# EAGLE design BayThreat (EAGLE 5.11)

## Sheet 1 of 3
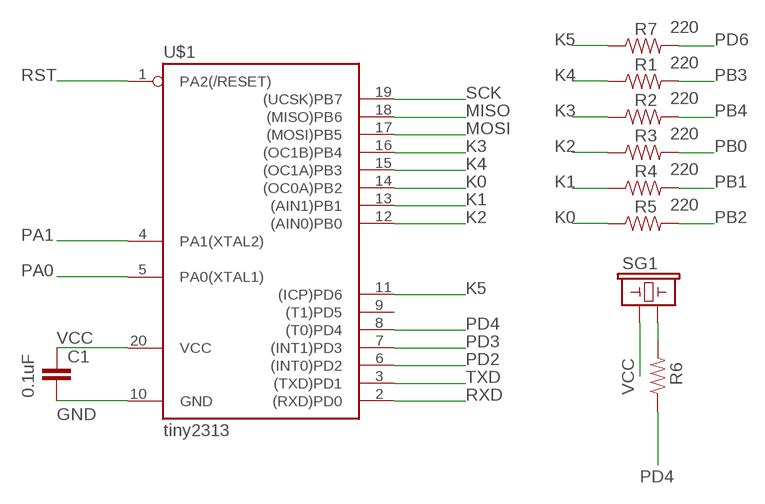
[diagram p0: schematic, sheet 1]

### Parts
C1  0.1uF  CAP_  [AXIAL-5MM]
R1  220  RESISTORPTH1  [AXIAL-0.3]
R2  220  RESISTORPTH1  [AXIAL-0.3]
R3  220  RESISTORPTH1  [AXIAL-0.3]
R4  220  RESISTORPTH1  [AXIAL-0.3]
R5  220  RESISTORPTH1  [AXIAL-0.3]
R6  RESISTORPTH1  [AXIAL-0.3]
R7  220  RESISTORPTH1  [AXIAL-0.3]
SG1  BUZZERPTH  [BUZZER-12MM]
U$1  tiny2313  TINY2313-*P*  [DIL20]

### Nets
GND: C1.P$2 U$1.10(GND) ; also sheet 3
K0 [LED]: R5.P$1 U$1.14((OC0A)PB2)
K1 [LED]: R4.P$1 U$1.13((AIN1)PB1)
K2 [LED]: R3.P$1 U$1.12((AIN0)PB0)
K3 [LED]: R2.P$1 U$1.16((OC1B)PB4)
K4 [LED]: R1.P$1 U$1.15((OC1A)PB3)
K5: R7.P$1 U$1.11((ICP)PD6)
MISO: U$1.18((MISO)PB6) ; also sheet 3
MOSI: U$1.17((MOSI)PB5) ; also sheet 3
N$4: R6.P$2 SG1.-
PA0: U$1.5(PA0(XTAL1))
PA1: U$1.4(PA1(XTAL2))
PB0: R3.P$2 ; also sheet 2
PB1: R4.P$2 ; also sheet 2
PB2 [LED]: R5.P$2 ; also sheet 2
PB3: R1.P$2 ; also sheet 2
PB4: R2.P$2 ; also sheet 2
PD2: U$1.6((INT0)PD2) ; also sheet 3
PD3: U$1.7((INT1)PD3)
PD4: R6.P$1 U$1.8((T0)PD4)
PD6: R7.P$2 ; also sheet 2
RST: U$1.1(PA2(/RESET)) ; also sheet 3
RXD: U$1.2((RXD)PD0)
SCK: U$1.19((UCSK)PB7) ; also sheet 3
TXD: U$1.3((TXD)PD1)
VCC: C1.P$1 SG1.+ U$1.20(VCC) ; also sheet 3
Unconnected: U$1.9((T1)PD5)

## Sheet 2 of 3
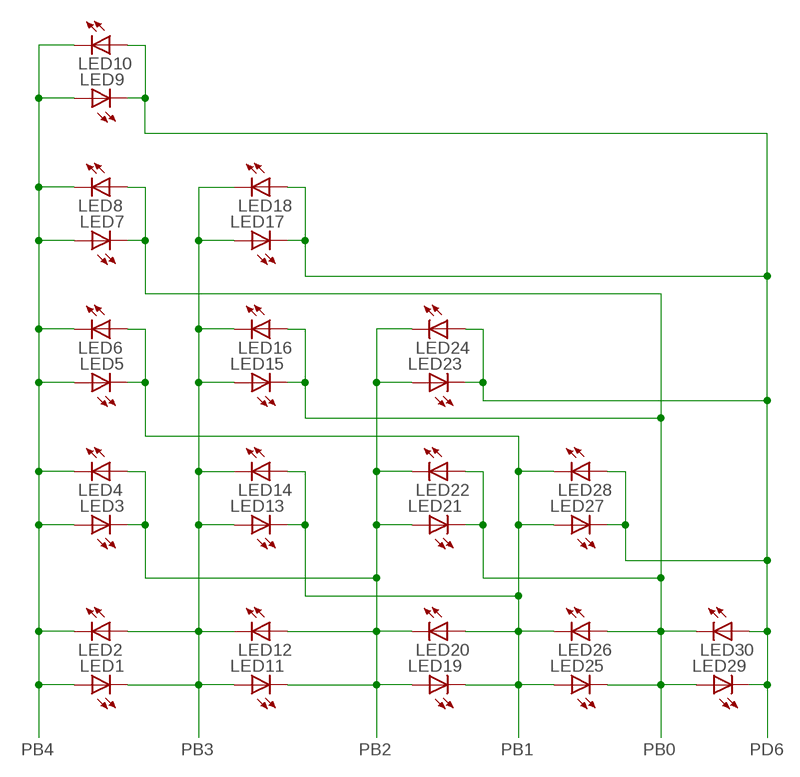
[diagram p1: schematic, sheet 2]

### Parts
LED1  LED3MM  [LED3MM]
LED2  LED3MM  [LED3MM]
LED3  LED3MM  [LED3MM]
LED4  LED3MM  [LED3MM]
LED5  LED3MM  [LED3MM]
LED6  LED3MM  [LED3MM]
LED7  LED3MM  [LED3MM]
LED8  LED3MM  [LED3MM]
LED9  LED3MM  [LED3MM]
LED10  LED3MM  [LED3MM]
LED11  LED3MM  [LED3MM]
LED12  LED3MM  [LED3MM]
LED13  LED3MM  [LED3MM]
LED14  LED3MM  [LED3MM]
LED15  LED3MM  [LED3MM]
LED16  LED3MM  [LED3MM]
LED17  LED3MM  [LED3MM]
LED18  LED3MM  [LED3MM]
LED19  LED3MM  [LED3MM]
LED20  LED3MM  [LED3MM]
LED21  LED3MM  [LED3MM]
LED22  LED3MM  [LED3MM]
LED23  LED3MM  [LED3MM]
LED24  LED3MM  [LED3MM]
LED25  LED3MM  [LED3MM]
LED26  LED3MM  [LED3MM]
LED27  LED3MM  [LED3MM]
LED28  LED3MM  [LED3MM]
LED29  LED3MM  [LED3MM]
LED30  LED3MM  [LED3MM]

### Nets
PB0: LED7.K(C) LED8.A LED15.K(C) LED16.A LED21.K(C) LED22.A LED25.K(C) LED26.A LED29.A LED30.K(C) ; also sheet 1
PB1: LED5.K(C) LED6.A LED13.K(C) LED14.A LED19.K(C) LED20.A LED25.A LED26.K(C) LED27.A LED28.K(C) ; also sheet 1
PB2 [LED]: LED3.K(C) LED4.A LED11.K(C) LED12.A LED19.A LED20.K(C) LED21.A LED22.K(C) LED23.A LED24.K(C) ; also sheet 1
PB3: LED1.K(C) LED2.A LED11.A LED12.K(C) LED13.A LED14.K(C) LED15.A LED16.K(C) LED17.A LED18.K(C) ; also sheet 1
PB4: LED1.A LED2.K(C) LED3.A LED4.K(C) LED5.A LED6.K(C) LED7.A LED8.K(C) LED9.A LED10.K(C) ; also sheet 1
PD6: LED9.K(C) LED10.A LED17.K(C) LED18.A LED23.K(C) LED24.A LED27.K(C) LED28.A LED29.K(C) LED30.A ; also sheet 1

## Sheet 3 of 3
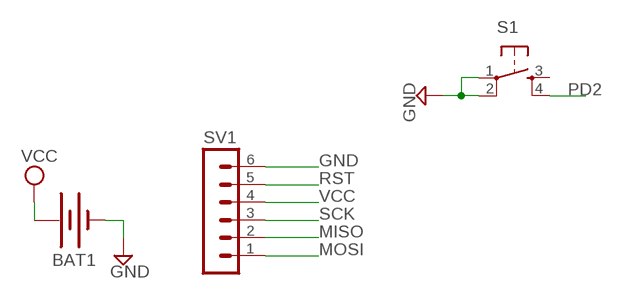
[diagram p2: schematic, sheet 3]

### Parts
BAT1  SPARKFUN_BATTERY245PTH  [SPARKFUN_BATTCON_245MM_PTH]
S1  TAC_SWITCHPTH  [TACTILE-PTH]
SV1  MA06-1  [MA06-1]

### Nets
GND: BAT1.2(-) S1.1 S1.2 SV1.6 ; also sheet 1
MISO: SV1.2 ; also sheet 1
MOSI: SV1.1 ; also sheet 1
PD2: S1.4 ; also sheet 1
RST: SV1.5 ; also sheet 1
SCK: SV1.3 ; also sheet 1
VCC: BAT1.3(+) SV1.4 ; also sheet 1
Unconnected: S1.3

## Library data of the parts
BAT1 = NSL:SPARKFUN_BATTERY: Battery Holders Various common sizes : AA, AAA, 20mm coin cell and 12mm coin cell.
C1 = SparkFun:CAP: Capacitor Standard 0603 ceramic capacitor, and 0.1" leaded capacitor.
LED1-LED30 = led:LED: LED OSRAM: - CHIPLED LG R971, LG N971, LY N971, LG Q971, LY Q971, LO R971, LY R971 LH N974, LH R974 LS Q976, LO Q976, LY Q976 LO Q996 - Hyper CHIPLED LW Q18S LB Q993, LB Q99A, LB R99A - SideLED LS A670, LO A670, LY A670, LG A670, LP A670 LB A673, LV A673, LT A673, LW A673 LH A674 LY A675 LS A676, LA A676, LO A676, LY A676, LW A676 LS A679, LY A679, LG A679 - Hyper Micro SIDELED® LS Y876, LA Y876, LO Y876, LY Y876 LT Y87S - SmartLED LW L88C, LW L88S LB L89C, LB L89S, LG L890 LS L89K, LO L89K, LY L89K LS L896, LA L896, LO L896, LY L896 - TOPLED LS T670, LO T670, LY T670, LG T670, LP T670 LSG T670, LSP T670, LSY T670, LOP T670, LYG T670 LG T671, LOG T671, LSG T671 LB T673, LV T673, LT T673, LW T673 LH T674 LS T676, LA T676, LO T676, LY T676, LB T676, LH T676, LSB T676, LW T676 LB T67C, LV T67C, LT T67C, LS T67K, LO T67K, LY T67K, LW E67C LS E67B, LA E67B, LO E67B, LY E67B, LB E67C, LV E67C, LT E67C LW T67C LS T679, LY T679, LG T679 LS T770, LO T770, LY T770, LG T770, LP T770 LB T773, LV T773, LT T773, LW T773 LH T774 LS E675, LA E675, LY E675, LS T675 LS T776, LA T776, LO T776, LY T776, LB T776 LHGB T686 LT T68C, LB T68C - Hyper Mini TOPLED® LB M676 - Mini TOPLED Santana® LG M470 LS M47K, LO M47K, LY M47K Source: http://www.osram.convergy.de LUXEON: - LUMILED® LXK2-PW12-R00, LXK2-PW12-S00, LXK2-PW14-U00, LXK2-PW14-V00 LXK2-PM12-R00, LXK2-PM12-S00, LXK2-PM14-U00 LXK2-PE12-Q00, LXK2-PE12-R00, LXK2-PE12-S00, LXK2-PE14-T00, LXK2-PE14-U00 LXK2-PB12-K00, LXK2-PB12-L00, LXK2-PB12-M00, LXK2-PB14-N00, LXK2-PB14-P00, LXK2-PB14-Q00 LXK2-PR12-L00, LXK2-PR12-M00, LXK2-PR14-Q00, LXK2-PR14-R00 LXK2-PD12-Q00, LXK2-PD12-R00, LXK2-PD12-S00 LXK2-PH12-R00, LXK2-PH12-S00 LXK2-PL12-P00, LXK2-PL12-Q00, LXK2-PL12-R00 Source: www.luxeon.com KINGBRIGHT: KA-3528ASYC Source: www.kingbright.com
R1-R5 R7 = NSL:RESISTOR: Resistor Basic schematic elements and footprints for 0603, 1206, and PTH 1/10th watt (small) resistors.
R6 = SparkFun:RESISTOR: Resistor Basic schematic elements and footprints for 0603, 1206, and PTH 1/10th watt (small) resistors.
S1 = SparkFun:TAC_SWITCH: Momentary Switch Button commonly used for reset or general input. Spark Fun Electronics SKU : COM-00097
SG1 = SparkFun:BUZZER: Buzzer 12mm Spark Fun Electronics SKU : Comp-Buzzer
SV1 = NSL:MA06-1: PIN HEADER
U$1 = NSL_Cylon:TINY2313*: Atmel Tiny2313 2K Flash, 128 bytes EEPROM, 128 bytes RAM

## Net classes
0 default: width 0.254 mm
1 LED: width 0.203 mm

## Board
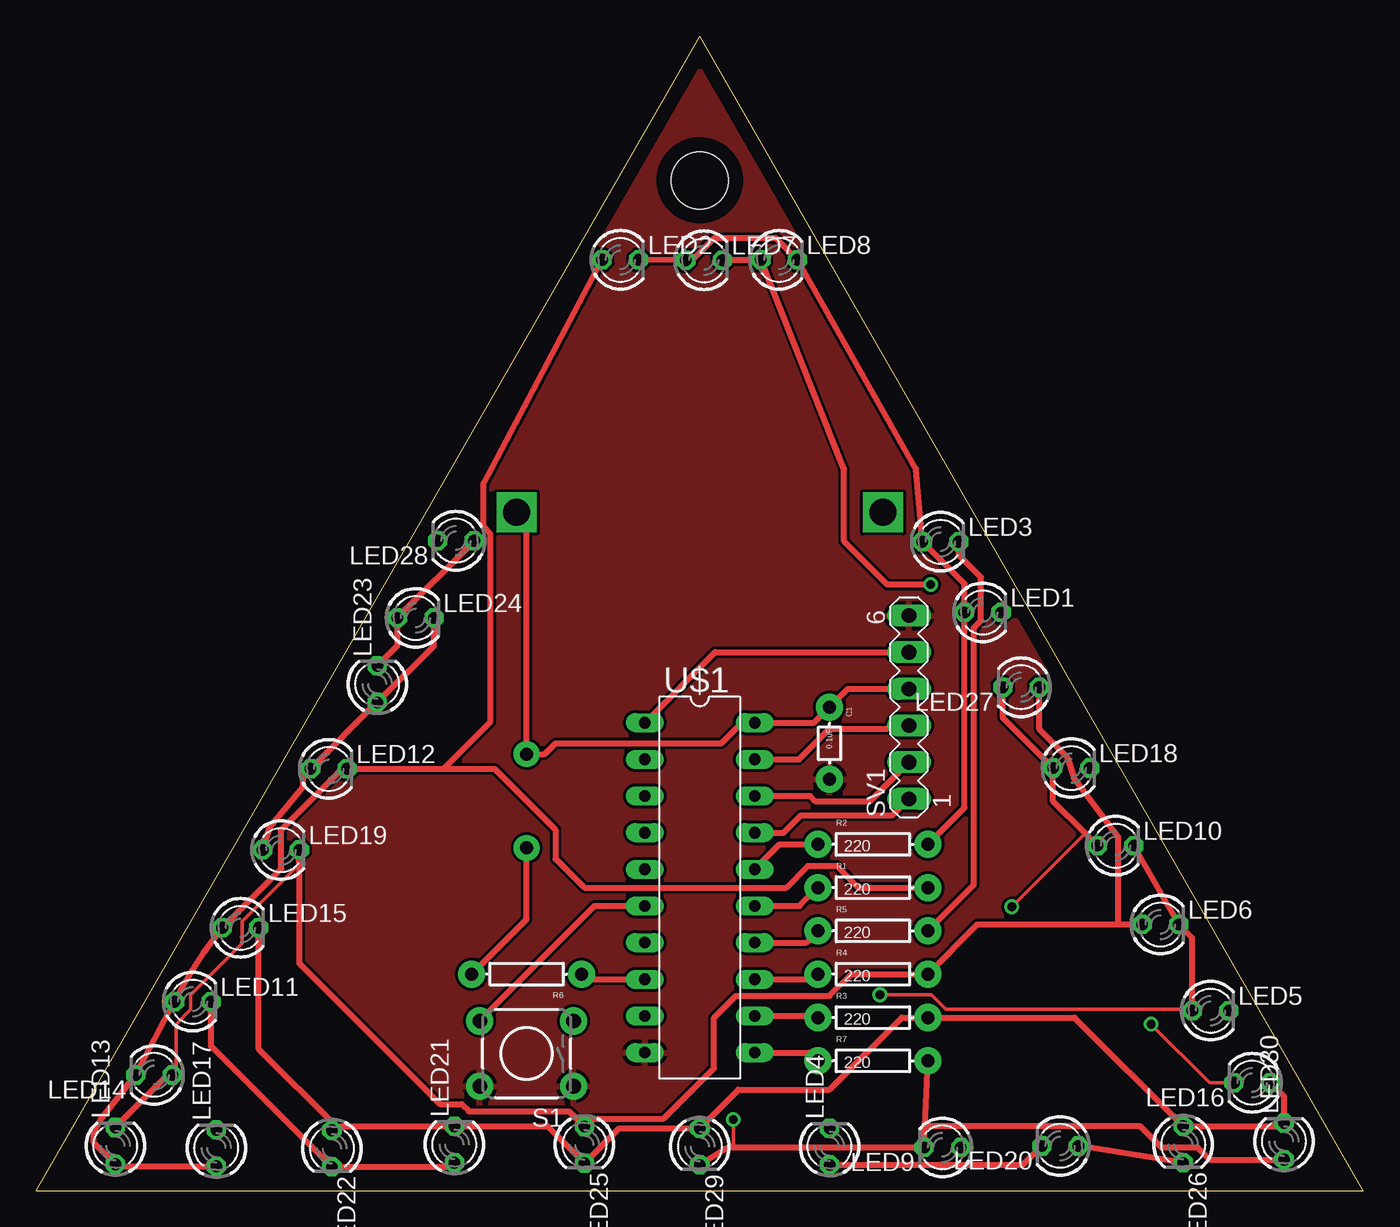
[diagram p3: board, top side]
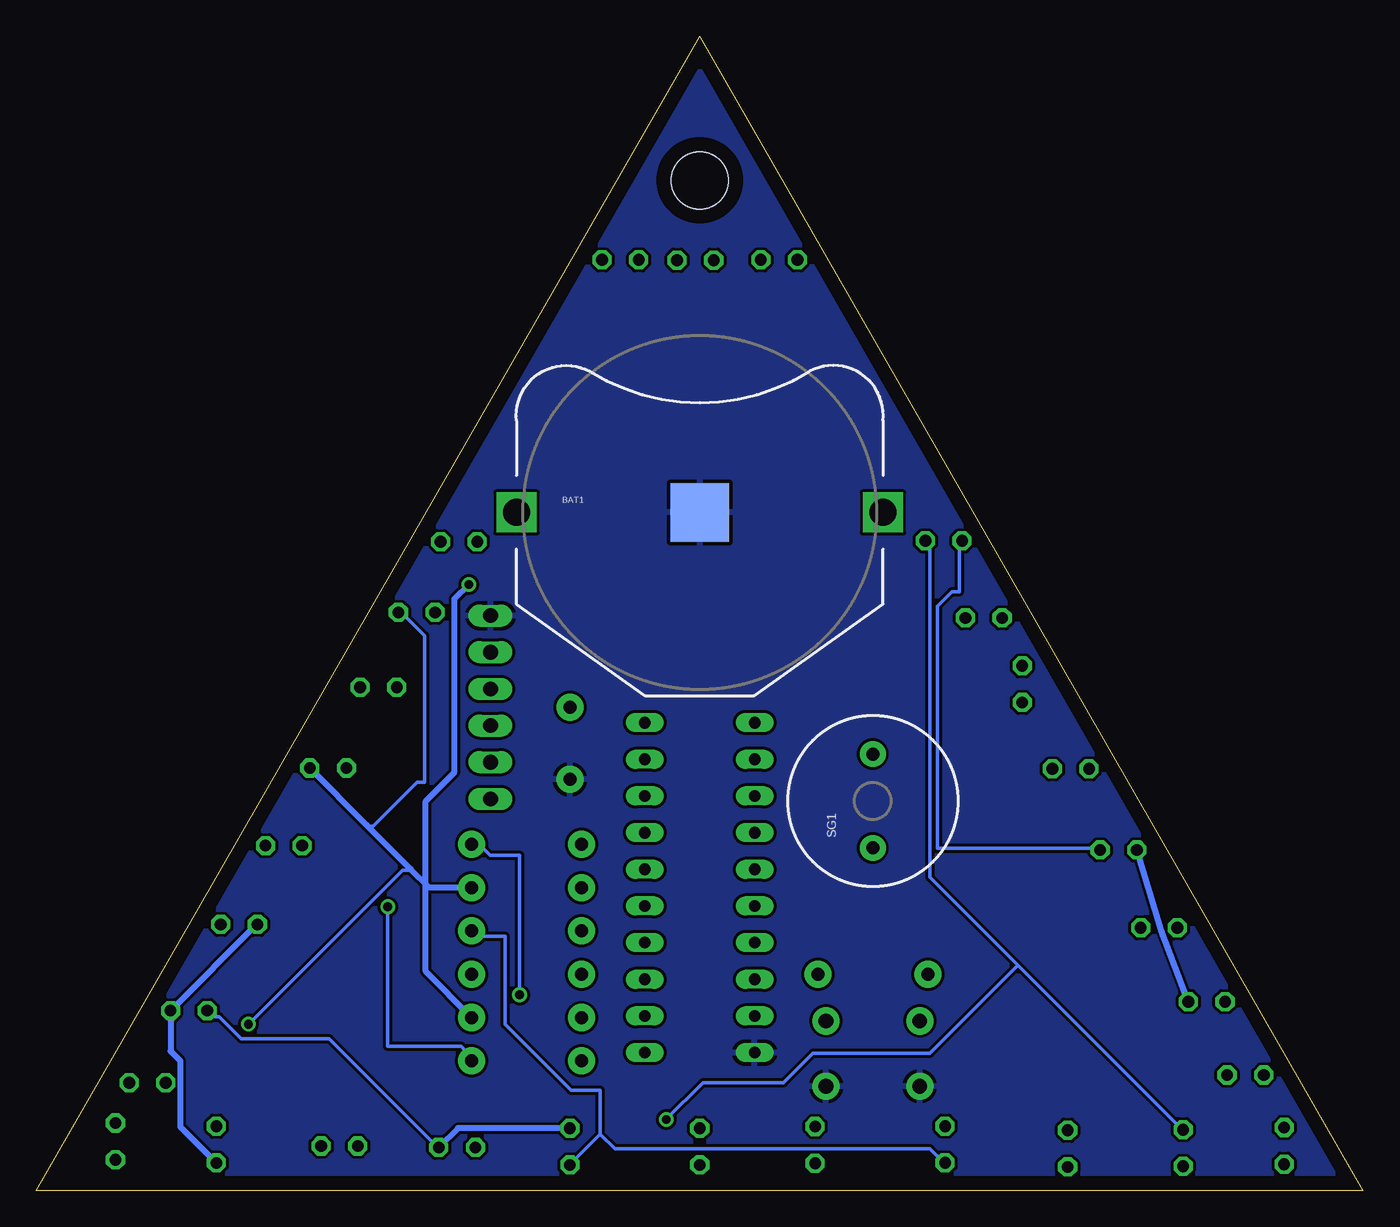
[diagram p4: board, bottom side, seen from below]

Size 92 x 80 mm. Coordinates in mm from the lower left corner, seen from the top.
Outline: 92,0 46,80 0,0 92,0
Copper layers (1*16): Top 0.035mm / dielectric 1.5mm / Bottom 0.035mm
Design rules "default": minimum track width 10mil, minimum drill 24mil, track to track 8mil, track to pad 8mil, pad to pad 8mil, via to via 8mil, smd to smd 8mil, copper to edge 40mil, drill to drill 8mil, minimum pad ring 10mil, minimum via ring 8mil, stop-mask expansion 4mil, vias tented up to drill 0mil, thermal gap 10mil
Holes 3.94 mm at 46,70

### Footprints (pad centres in the part's own frame; a part is rotated, then mirrored left to right if it is on the bottom)
SPARKFUN_BATTCON_245MM_PTH = drill 1.854 square: 1 -12.7,0; 3 12.7,0 | smd 4.064 x 4.064: 2 0,0
AXIAL-5MM = drill 0.9 pad 1.88 round: P$1 -2.5,0; P$2 2.5,0
LED3MM = drill 0.813 octagon: A -1.27,0; K 1.27,0
AXIAL-0.3 = drill 0.9 pad 1.88 round: P$1 -3.81,0; P$2 3.81,0
TACTILE-PTH = drill 1.016 pad 1.88 round: 1 -3.251,2.261; 2 3.251,2.261; 3 -3.251,-2.261; 4 3.251,-2.261
BUZZER-12MM = drill 0.9 pad 1.778 round: + 3.25,0; - -3.25,0
MA06-1 = drill 1.016 long: 1 -6.35,0; 2 -3.81,0; 3 -1.27,0; 4 1.27,0; 5 3.81,0; 6 6.35,0
DIL20 = drill 0.813 long: 1 -11.43,-3.81; 2 -8.89,-3.81; 3 -6.35,-3.81; 4 -3.81,-3.81; 5 -1.27,-3.81; 6 1.27,-3.81; 7 3.81,-3.81; 8 6.35,-3.81; 9 8.89,-3.81; 10 11.43,-3.81; 11 11.43,3.81; 12 8.89,3.81; 13 6.35,3.81; 14 3.81,3.81; 15 1.27,3.81; 16 -1.27,3.81; 17 -3.81,3.81; 18 -6.35,3.81; 19 -8.89,3.81; 20 -11.43,3.81

### Placement (x,y rotation side)
BAT1  46,47 0 bottom
C1  55,31 270 top
LED1  65.62,40.07 0 top
LED2  40.5,64.5 0 top
LED3  62.69,44.97 0 top
LED4  55,3.06 90 top
LED5  81.41,12.48 0 top
LED6  77.93,18.45 0 top
LED7  46.3,64.47 0 top
LED8  51.5,64.5 0 top
LED9  62.82,3 180 top
LED10  74.83,23.91 0 top
LED11  10.86,13.1 0 top
LED12  20.29,29.23 0 top
LED13  5.5,3.11 90 top
LED14  8.18,8.02 180 top
LED15  14.17,18.22 0 top
LED16  84.28,7.48 180 top
LED17  12.5,2.96 90 top
LED18  71.76,29.29 0 top
LED19  16.98,23.61 0 top
LED20  70.97,3.1 180 top
LED21  29,3.2 90 top
LED22  20.5,2.92 270 top
LED23  23.65,35.1 90 top
LED24  26.31,39.69 0 top
LED25  38,3.18 270 top
LED26  79.5,3.2 270 top
LED27  68.27,34.88 180 top
LED28  29.09,45.03 180 top
LED29  46,3.06 270 top
LED30  86.5,3.42 90 top
R1  58,21 0 top
R2  58,24 0 top
R3  58,12 0 top
R4  58,15 0 top
R5  58,18 0 top
R6  34,15 180 top
R7  58,9 0 top
S1  34,9.5 180 top
SG1  34,27 90 bottom
SV1  60.5,33.5 90 top
U$1  46,21 270 top

### Tracks (layer width: path | path; a pad name or v marks a point on that pad's centre or on a via)
GND
  pour Top: 0,0 92,0 46,80
  pour Bottom: 46,80 0,0 92,0
K0
  Top 0.406: U$1.14 53.38,17.19 R5.P$1
K1
  Top 0.406: U$1.13 53.84,14.65 R4.P$1
K2
  Top 0.406: U$1.12 54.08,12.11 R3.P$1
K3
  Top 0.406: R2.P$1 51.54,24 U$1.16
K4
  Top 0.406: U$1.15 52.92,19.73 R1.P$1
K5
  Top 0.406: U$1.11 53.62,9.57 R7.P$1
MISO
  Top 0.406: U$1.18 53.65,27.35 54,27 57.81,27 SV1.2
MOSI
  Top 0.406: U$1.17 51.81,24.81 53,26 59.35,26 SV1.1
N$4
  Top 0.406: R6.P$2 34,18.81 SG1.-
PB0  (via drill 0.6)
  Top 0.406: LED7.K 50.2,64.47 arc90 LED8.A 56,50 56,45 59,42 v62,42 | LED16.A 86.5,6.53 LED30.K 86.28,4.47 LED26.A 71.97,12 R3.P$2 60,12 55,7 48.67,7 LED29.A 40.42,4.33 LED25.K 35.44,4.47 LED21.K 20.79,4.47 | LED22.A 20.79,4.47 | 20.79,4.47 15.44,9.82 LED15.K
  Bottom 0.406: v62,42 63,41 63,29 65,27 65,15.19 R3.P$2
PB1
  Top 0.254: LED14.A 9.72,8.5 9.72,11.54 10.73,12.56 10.73,13.58 14.29,17.13 14.29,18.66 18.35,22.72 18.25,22.72
  Top 0.406: 75,18.45 65.26,18.45 R4.P$2 56.5,15 55,13.5 48.5,13.5 47,12 47,8.5 43.5,5 38.55,5 LED25.A 36.95,5.5 30,5.5 29.5,6 28,6 18.25,15.75 18.25,22.72 LED19.K | 75,18.45 LED6.A | LED13.K 9.14,8.02 LED14.A | LED26.K LED20.A | LED27.A 69.54,31.96 71.5,30 72,28.5 75,24.5 75,18.45
  Bottom 0.254: LED28.K 28,44.56 28,41.52 28.51,41.52 29.53,40.5 29.53,23.74 18.35,23.74 LED19.K
  Bottom 0.406: LED26.K 82,4.43 82,9 82.68,9.68 LED5.K 76.71,18.45 LED6.A
PB2
  Top 0.406: LED3.K 63.96,44.04 65.5,42.5 65.5,39.5 65,39 65,21.19 R5.P$2 | LED19.A 16.21,25.21 18.5,28 18.5,28.71 LED12.A 23.62,33.83 LED23.A 27.58,37.76 LED24.K | LED11.K 12.13,10.02 LED22.K 28.71,1.65 arc90 LED21.A | LED20.K 68.39,1.79 LED4.A
  Bottom 0.254: 52.9,3.92 54.93,1.89 LED4.A | 52.9,3.92 52.9,6.97 54.93,6.97 59.5,11.54 59.5,17.64 61.53,17.64 R5.P$2 | 52.9,3.92 51.88,2.91 30.04,2.91 29.53,2.4 29.02,2.4 LED21.A
  Bottom 0.406: LED19.A 14,18 LED11.K
PB3  (via drill 0.61)
  Top 0.254: v77.28,11.54 81.34,7.48 LED16.K
  Top 0.406: 28.23,29.23 LED12.K 21.23,29.23 17,25 17,22.32 LED15.A arc10 LED11.A LED14.K 4.5,5 4,4 4,3.34 LED13.A 5.65,1.69 LED17.A | LED2.A 31,49 31,46 31.5,45.5 31.5,32.5 28.23,29.23 | R1.P$2 57,21 55.5,22.5 53.5,22.5 52,21 38,21 36,23 36,25 31.77,29.23 28.23,29.23
  Bottom 0.254: v77.28,11.54 66.61,22.21 66.1,22.21 66.03,22.29 | LED1.K 66.61,39.99 65.09,38.47 65.09,28.31 65.6,28.31 68.64,25.26 69.15,25.26 69.08,25.34
  Bottom 0.406: R1.P$2 64.74,21 66.03,22.29 69.08,25.34 LED18.K
PB4  (via drill 0.61)
  Top 0.254: v58.48,13.58 62.04,13.58 63.06,12.56 79.82,12.56 LED5.A
  Top 0.406: LED2.K LED7.A 45.47,64.47 47,66 51.27,66 LED8.K 61,50 LED3.A 64.35,42.04 LED1.A 64.35,26.54 R2.P$2 | LED5.A 80.14,17.51 LED6.K LED10.K
  Bottom 0.254: LED9.A 64.58,3.42 71.69,10.53 77.79,10.53 79.31,12.05 79.82,12.05 LED5.A | v58.48,13.58 58.48,23.23 60.52,23.23 61.02,23.74 61.53,23.74 R2.P$2
  Bottom 0.406: LED4.K 62.75,4.33 LED9.A
PD2
  Top 0.406: S1.4 38.72,19.73 U$1.6
PD4
  Top 0.406: R6.P$1 38.16,14.65 U$1.8
PD6  (via drill 0.61)
  Top 0.254: v67.63,19.67 72.71,24.76 | v48.32,4.94 48.32,3 48.32,2.91
  Top 0.406: LED28.A 30.36,45.01 LED24.A 25.04,37.76 LED23.K | LED27.K 67,32.78 LED18.A 70.49,26.98 72.71,24.76 LED10.A | 61.61,4.47 LED9.K 48.32,3 48,3 LED29.K | 61.61,4.47 R7.P$2 | LED30.A 81.35,2.15 80.5,3 78,3 76.5,4.5 61.64,4.5 61.61,4.47
  Bottom 0.254: v67.63,19.67 67.63,10.02 62.55,10.02 61.53,9 R7.P$2 | 23.94,15.61 30.04,21.7 30.04,44.56 LED28.A | 23.94,15.61 12.76,4.43 LED17.K | v48.32,4.94 45.78,7.48 40.2,7.48 38.16,9.51 30.04,9.51 23.94,15.61
RST
  Top 0.406: U$1.1 47.07,37.31 SV1.5
SCK
  Top 0.406: U$1.19 52.89,29.89 55,32 59,32 59.23,32.23 SV1.3
VCC
  Top 0.406: SV1.4 56.27,34.77 C1.P$1 53.93,32.43 U$1.20 48.93,32.43 47.5,31 36,31 35.25,30.25 SG1.+ 34,46.3 BAT1.3